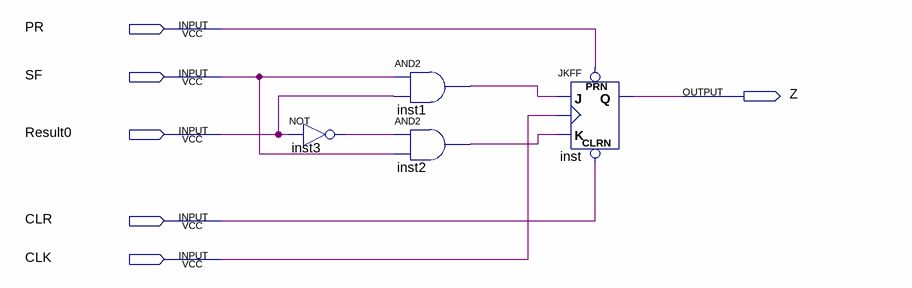
[diagram p0: schematic sheet]
// Quartus schematic Z_FLag.bdf as structural Verilog: 4 symbols, 6 pins
module Z_FLag (
  input  PR,
  input  SF,
  input  Result0,
  input  CLR,
  input  CLK,
  output Z
);

  wire inst1_out, inst2_out, inst3_out;

  not inst3 (inst3_out, Result0);
  and inst1 (inst1_out, SF, Result0);
  and inst2 (inst2_out, inst3_out, SF);
  JKFF inst (.PRN(PR), .CLRN(CLR), .K(inst2_out), .J(inst1_out), .CLK(CLK), .Q(Z));
endmodule
